# EAGLE schematic LBM313_AD8232 (EAGLE 6.6.0)
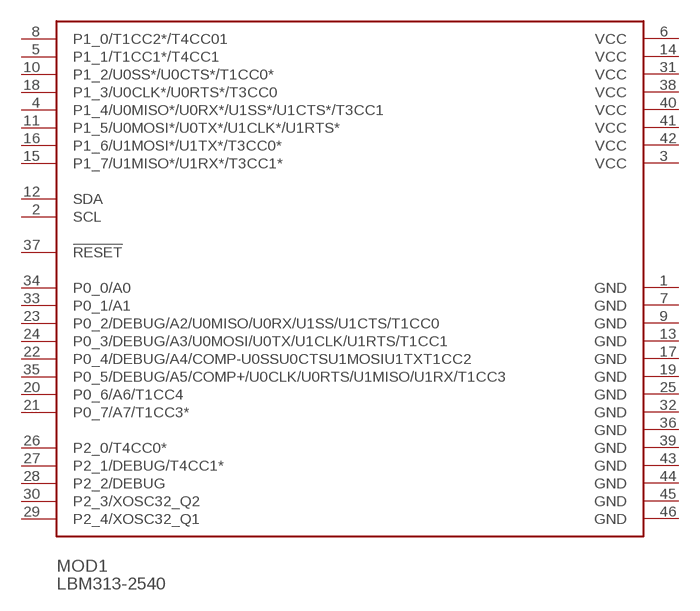
[diagram p0: schematic, sheet 1]

## Parts
MOD1  LBM313-2540  [LBM313-2540]
Unconnected: MOD1.1(GND) MOD1.2(SCL) MOD1.3(VCC) MOD1.4(P1_4/U0MISO*/U0RX*/U1SS*/U1CTS*/T3CC1) MOD1.5(P1_1/T1CC1*/T4CC1) MOD1.6(VCC) MOD1.7(GND) MOD1.8(P1_0/T1CC2*/T4CC01) MOD1.9(GND) MOD1.10(P1_2/U0SS*/U0CTS*/T1CC0*) MOD1.11(P1_5/U0MOSI*/U0TX*/U1CLK*/U1RTS*) MOD1.12(SDA) MOD1.13(GND) MOD1.14(VCC) MOD1.15(P1_7/U1MISO*/U1RX*/T3CC1*) MOD1.16(P1_6/U1MOSI*/U1TX*/T3CC0*) MOD1.17(GND) MOD1.18(P1_3/U0CLK*/U0RTS*/T3CC0) MOD1.19(GND) MOD1.20(P0_6/A6/T1CC4) MOD1.21(P0_7/A7/T1CC3*) MOD1.22(P0_4/DEBUG/A4/COMP-U0SSU0CTSU1MOSIU1TXT1CC2) MOD1.23(P0_2/DEBUG/A2/U0MISO/U0RX/U1SS/U1CTS/T1CC0) MOD1.24(P0_3/DEBUG/A3/U0MOSI/U0TX/U1CLK/U1RTS/T1CC1) MOD1.25(GND) MOD1.26(P2_0/T4CC0*) MOD1.27(P2_1/DEBUG/T4CC1*) MOD1.28(P2_2/DEBUG) MOD1.29(P2_4/XOSC32_Q1) MOD1.30(P2_3/XOSC32_Q2) MOD1.31(VCC) MOD1.32(GND) MOD1.33(P0_1/A1) MOD1.34(P0_0/A0) MOD1.35(P0_5/DEBUG/A5/COMP+/U0CLK/U0RTS/U1MISO/U1RX/T1CC3) MOD1.36(GND) MOD1.37(!RESET!) MOD1.38(VCC) MOD1.39(GND) MOD1.40(VCC) MOD1.41(VCC) MOD1.42(VCC) MOD1.43(GND) MOD1.44(GND) MOD1.45(GND) MOD1.46(GND)

## Library data of the parts
MOD1 = LBM313-2540:LBM313-2540: Bluetooth 4.0 Module. Documentation at: http://punchthrough.com/docs/doku.php?id=lbm313